# Altium schematic sheet IO.SchDoc: HB+SPO2 | IO
size A4; DocumentNumber: 4; Revision: 2; SheetNumber: 4; SheetTotal: 4
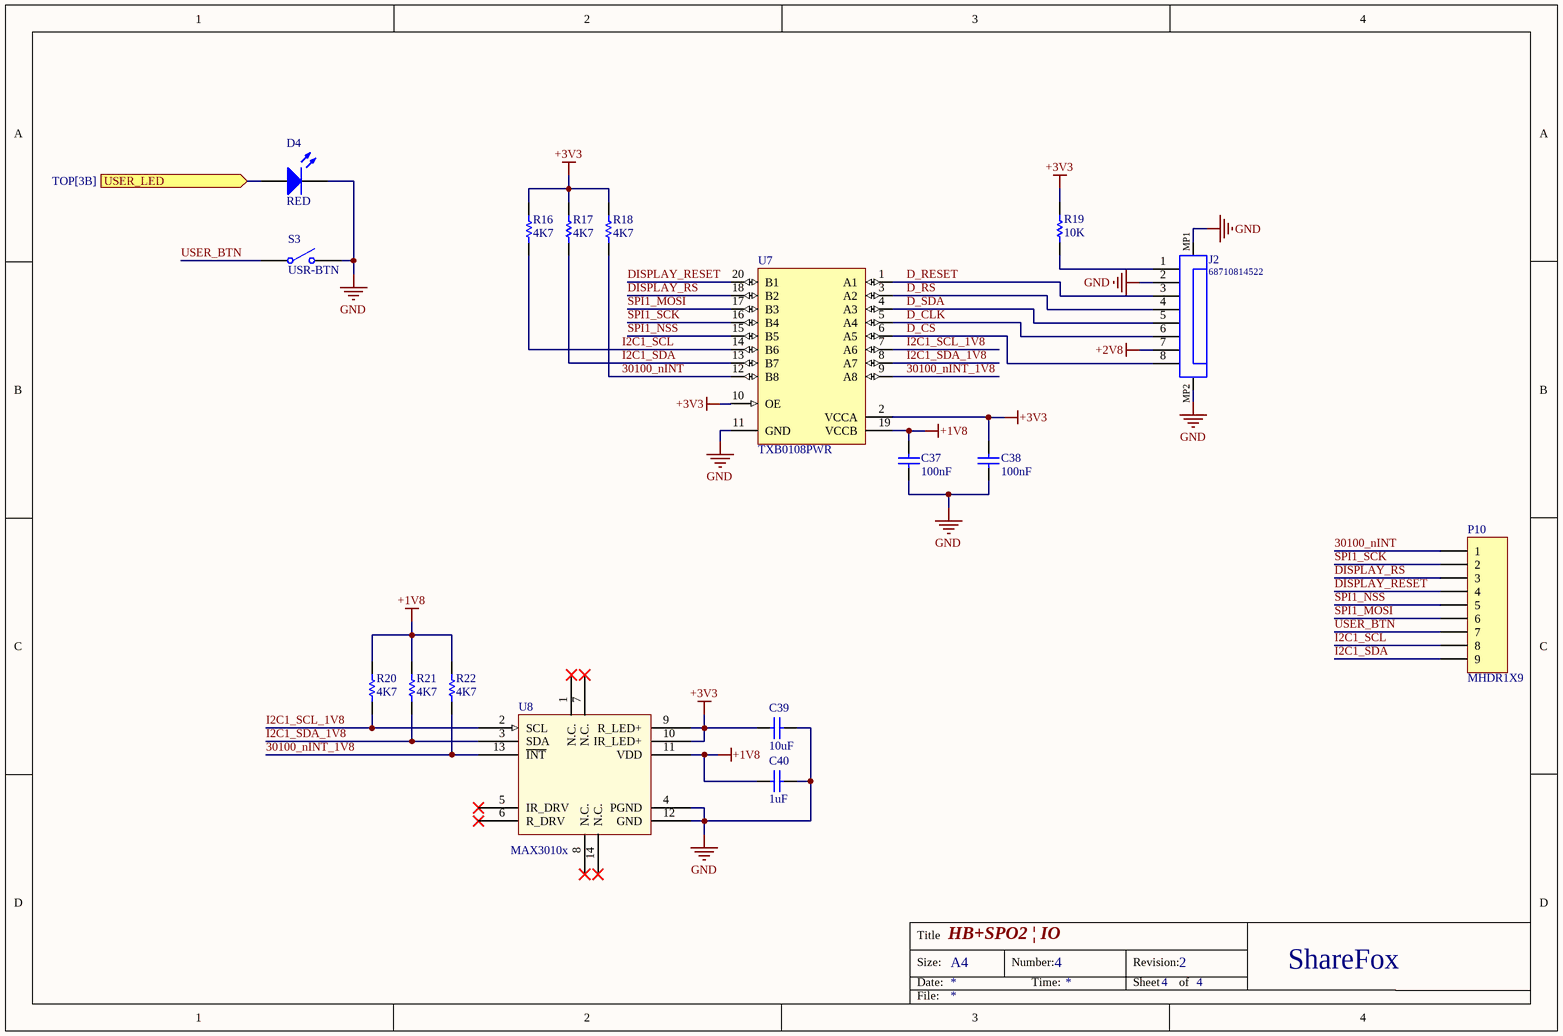
[diagram p0: IO.SchDoc]

## Parts
C37  100nF  [C_0603]
C38  100nF  [C_0603]
C39  10uF  [C_0805]
C40  1uF  [C_0603]
D4  RED  [D-0603]
J2  68710814522  [68710814522]
P10  MHDR1X9  [MHDR1X9]
R16  4K7  [C_0603]
R17  4K7  [C_0603]
R18  4K7  [C_0603]
R19  10K  [C_0603]
R20  4K7  [C_0603]
R21  4K7  [C_0603]
R22  4K7  [C_0603]
S3  USR-BTN  [HDR1X2]
U7  TXB0108PWR  [PW0020A_L]
U8  MAX3010x  [OESIP14R560x330]

## Ports
USER_LED (in, see TOP[3B])

## Nets
+1V8: C37.2 C40.2 R20.2 R21.2 R22.2 U7.19(VCCB) U8.11(VDD)
+2V8: J2.7
+3V3: C38.2 C39.2 R16.2 R17.2 R18.2 R19.1 U7.2(VCCA) U7.10(OE) U8.9(R_LED+) U8.10(IR_LED+)
GND: C37.1 C38.1 C39.1 C40.1 D4.2(K) J2.2 J2.MP1 J2.MP2 S3.2(NO) U7.11(GND) U8.4(PGND) U8.12(GND)
30100_nINT: P10.1 R18.1 U7.12(B8)
30100_nINT_1V8: R22.1 U7.9(A8) U8.13(~{INT})
D_CLK: J2.6 U7.5(A4)
D_CS: J2.8 U7.6(A5)
D_RESET: J2.3 U7.1(A1)
D_RS: J2.4 U7.3(A2)
D_SDA: J2.5 U7.4(A3)
DISPLAY_RESET: P10.4 U7.20(B1)
DISPLAY_RS: P10.3 U7.18(B2)
I2C1_SCL: P10.8 R16.1 U7.14(B6)
I2C1_SCL_1V8: R20.1 U7.7(A6) U8.2(SCL)
I2C1_SDA: P10.9 R17.1 U7.13(B7)
I2C1_SDA_1V8: R21.1 U7.8(A7) U8.3(SDA)
SPI1_MOSI: P10.6 U7.17(B3)
SPI1_NSS: P10.5 U7.15(B5)
SPI1_SCK: P10.2 U7.16(B4)
USER_BTN: P10.7 S3.1(COMMON)
USER_LED: D4.1(A) ; port USER_LED
NetJ2_1: J2.1 R19.2

Not connected (* = marked no-connect by the designer): U8 1(N.C.)* 5(IR_DRV)* 6(R_DRV)* 7(N.C.)* 8(N.C.)* 14(N.C.)*

## Notes on the sheet
- Title
- Size:
- Date:
- A4
- Number:
- Time:
- Revision:
- Sheet
- of
- ShareFox
- File:

## Library data of the parts
C37-C40 = Cap: Capacitor; Published: 8-Jun-2000; LatestRevisionDate: 17-Jul-2002; LatestRevisionNote: Re-released for DXP Platform.; PackageReference: RAD-0.3; Publisher: Altium Limited; PackageDescription: Radial Cap, Thru-Hole; 2 Leads; 0.3 in Pin Spacing
  C37 C38: Value: 100nF
  C39: Value: 10uF
  C40: Value: 1uF
D4 = LED2: Typical RED, GREEN, YELLOW, AMBER GaAs LED; Published: 8-Jun-2000; LatestRevisionDate: 17-Jul-2002; LatestRevisionNote: Re-released for DXP Platform.; PackageVersion: Feb-2002; PackageReference: 3.2X1.6X1.1; Publisher: Altium Limited; PackageDescription: SM LED; 2 Flat Leads
J2 = CMP-1502-01528-1: SMT ZIF Connectors WR-FPC, Horizontal, Bottom Contact, pitch 0.5 mm, 8 pins; Manufacturer: Wurth Elektronik; Contact Resistance: 20mOhm; Pitch: 0.5mm; Withstanding Voltage: 250VAC; Working Voltage: 50VAC; Pin Number: 8; Rated Current: 0.5A; Contact Design: BottomContact; Publisher: WurthElektronik; Orientation: Horizontal; Manufacturer URL: http://www.we-online.de; Part Number: 68710814522; Mounting Technology: SMT; Packaging: TapeandReel; Package Reference: 68710814522; Operating Temperature: -25to85degC; Datasheet URL: https://katalog.we-online.de/em/datasheet/68710814522.pdf
P10 = MHDR1X9: Header, 9-Pin; LatestRevisionDate: 17-Jul-2002; LatestRevisionNote: Re-released for DXP Platform.; Publisher: Altium Limited
R16-R22 = Res1: Resistor; Published: 8-Jun-2000; LatestRevisionDate: 17-Jul-2002; LatestRevisionNote: Re-released for DXP Platform.; PackageReference: AXIAL-0.3; Publisher: Altium Limited; PackageDescription: Axial Device, Thru-Hole; 2 Leads; 0.3 in Pin Spacing
  R16-R18 R20-R22: Value: 4K7
  R19: Value: 10K
S3 = SW-SPST: Single-Pole, Single-Throw Switch; Published: 24-Mar-1999; LatestRevisionDate: 17-Jul-2002; LatestRevisionNote: Re-released for DXP Platform.; PackageReference: SPST-2; Publisher: Altium Limited; PackageDescription: Switch; 2 Leads
U7 = CMP-2000-07337-1: TXB0108 8-Bit Bidirectional Voltage-Level Translator with Auto-Direction Sensing and / +/- 15-kV ESD Protection, 1.2 to 3.6 V, -40 to 85 degC, 20-Pin TSSOP (PW), Green (RoHS & no Sb/Br), Tape and Reel; Manufacturer: Texas Instruments; Propagation Delay (Max): 4ns; Logic Function: Translator,Bidirectional; Input Type: Logic; Package Version: 4040064-5/G, 02/2011; Voltage - Supply: 1.2V~3.6V,1.65V~5.5V; Data Rate: 100Mbps; Other Names: 296-21527-6; Number of Channels: 8; Differential - Input: Output:No/No; Number of Outputs/Channel: 1; Product Training Modules: VoltageLevelTranslation; Dynamic Catalog: TXBSeries; Package Reference: PW20; Package Description: 20-Pin Small Outline Package Integrated Circuit, Body 6.5 x 4.4 mm, Pitch 0.65 mm; Category: IntegratedCircuits(ICs); Datasheet URL: http://www.ti.com/general/docs/lit/getliterature.tsp?genericPartNumber=TXB0108&fileType=pdf; Package / Case: 20-TSSOP(0.173",4.40mmWidth); Family: Logic-Translators; Standard Package: 1; Series: -; Manufacturer URL: http://www.ti.com/; Number of Bits: 8; Package URL: http://www.ti.com/litv/pdf/mpds362; Output Type: Logic; Datasheet Version: Rev. F, 12/2014; Packaging: Digi-Reel®; Operating Temperature: -40°C~85°C; Supplier Device Package: 20-TSSOP; Mounting Technology: SurfaceMount
U8 = MAX3010x: Pulse Oximeter and Heart-Rate Sensor IC  for Wearable Health